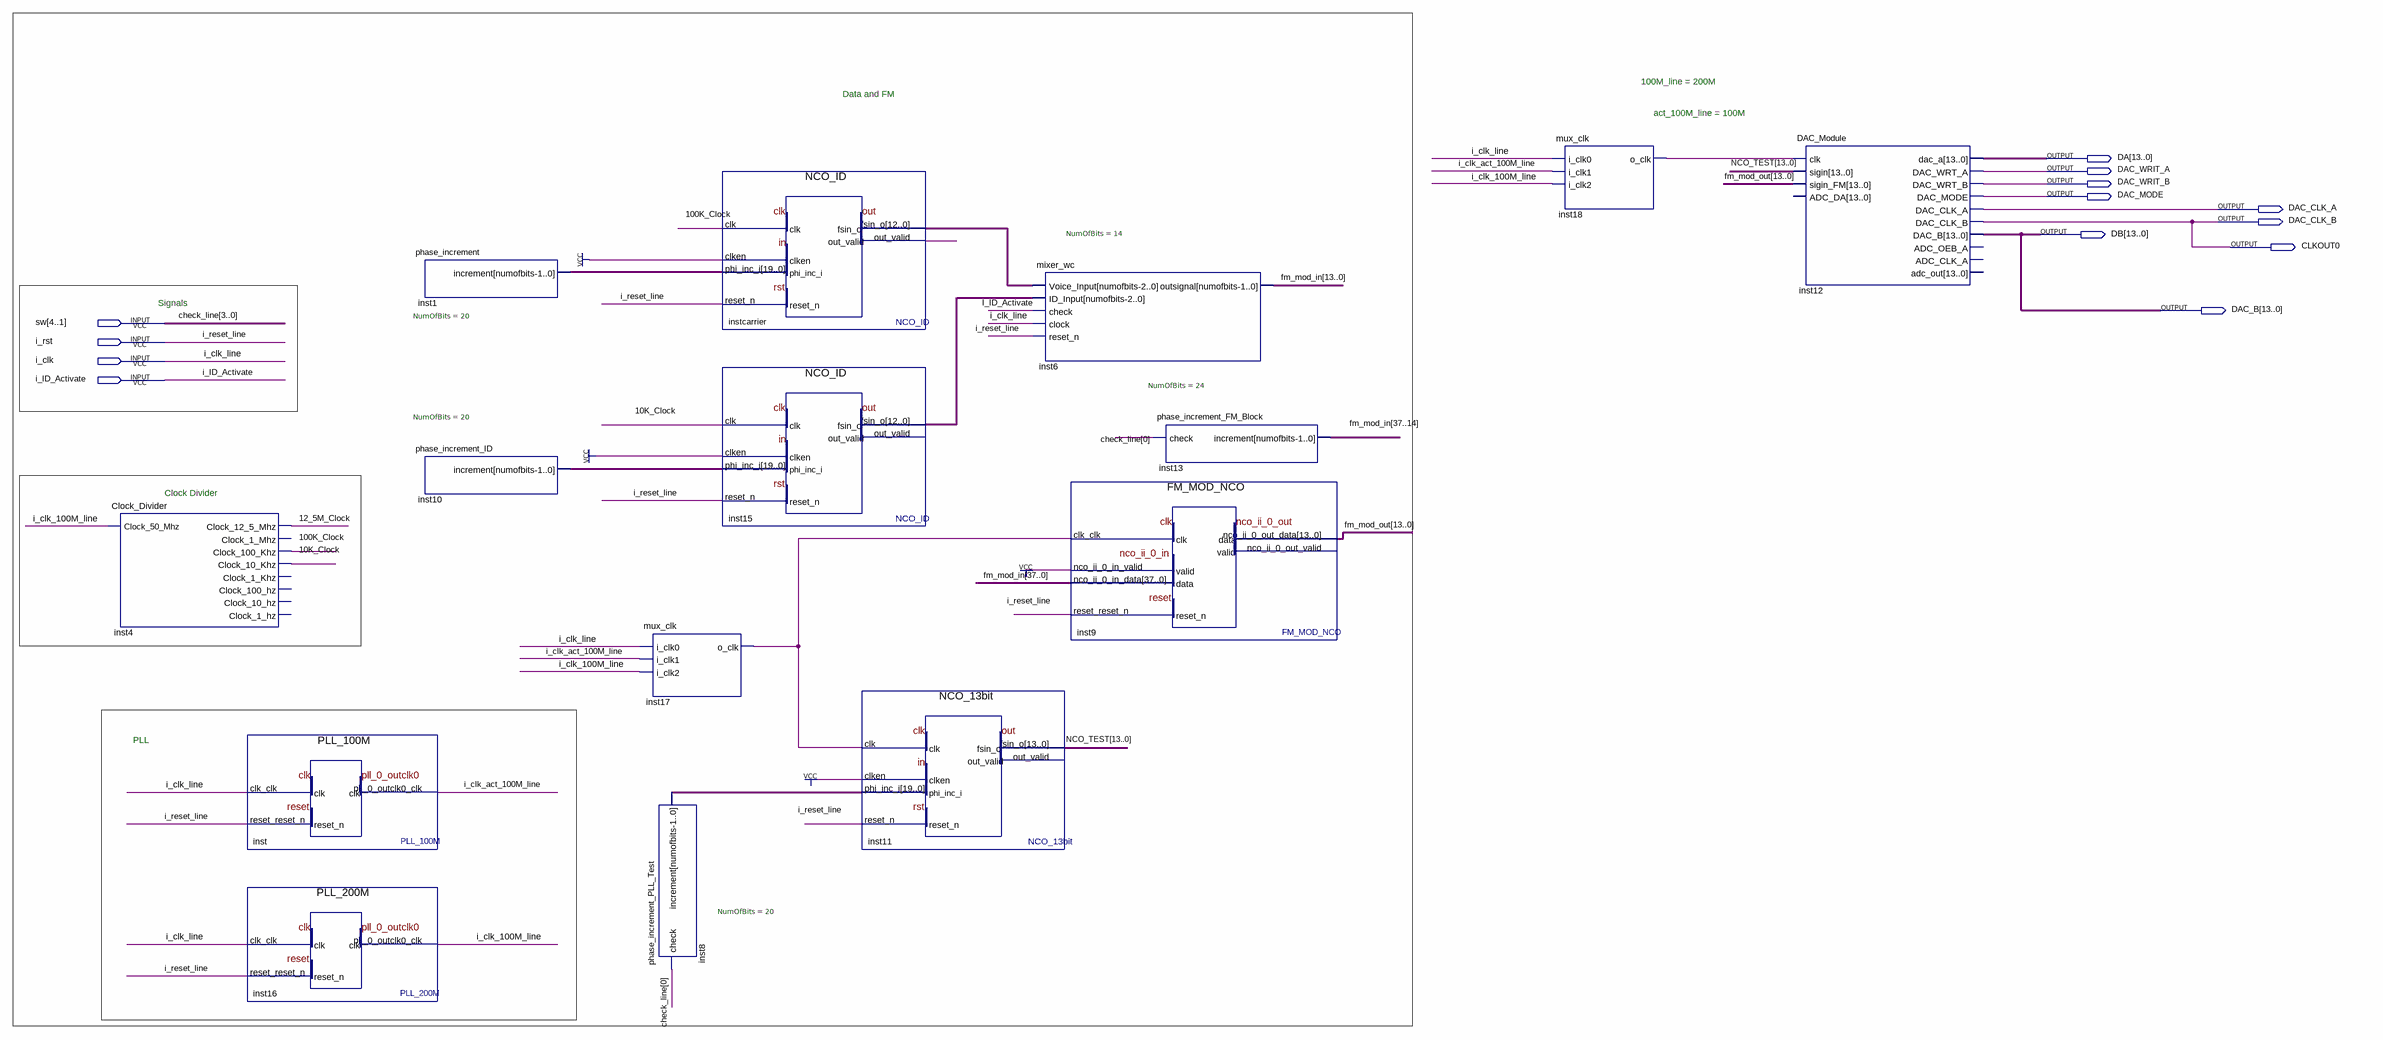
[diagram p0: schematic sheet]
// Quartus schematic Main_Data.bdf as structural Verilog: 15 symbols, 13 pins
module Main_Data (
  input  [4:1] sw,
  input  i_rst,
  input  i_clk,
  input  i_ID_Activate,
  output [13:0] DA,
  output DAC_WRIT_A,
  output DAC_WRIT_B,
  output DAC_MODE,
  output DAC_CLK_A,
  output DAC_CLK_B,
  output [13:0] DB,
  output CLKOUT0,
  output [13:0] DAC_B
);

  wire \10K_Clock , \12_5M_Clock , \100K_Clock , i_clk_100M_line, i_clk_act_100M_line, inst17_o_clk,
       inst18_o_clk, instcarrier_out_valid;
  wire [12:0] inst15_fsin_o, instcarrier_fsin_o;
  wire [13:0] fm_mod_out, NCO_TEST;
  wire [19:0] inst1_increment, inst8_increment, inst10_increment;
  wire [37:0] fm_mod_in;

  Clock_Divider inst4 (
    .Clock_50_Mhz(i_clk_100M_line), .Clock_12_5_Mhz(\12_5M_Clock ), .Clock_100_Khz(\100K_Clock ),
    .Clock_10_Khz(\10K_Clock ));  // open: Clock_1_Mhz, Clock_1_Khz, Clock_100_hz, Clock_10_hz, Clock_1_hz
  PLL_100M inst (.clk_clk(i_clk), .reset_reset_n(i_rst), .pll_0_outclk0_clk(i_clk_act_100M_line));
  PLL_200M inst16 (.clk_clk(i_clk), .reset_reset_n(i_rst), .pll_0_outclk0_clk(i_clk_100M_line));
  phase_increment #(.NumOfBits(20)) inst1 (.increment(inst1_increment));
  phase_increment_ID #(.NumOfBits(20)) inst10 (.increment(inst10_increment));
  mux_clk inst17 (.i_clk0(i_clk), .i_clk1(i_clk_act_100M_line), .i_clk2(i_clk_100M_line), .o_clk(inst17_o_clk));
  phase_increment_PLL_Test #(.NumOfBits(20)) inst8 (.check(sw[1]), .increment(inst8_increment));
  NCO_ID instcarrier (
    .clk(\100K_Clock ), .clken(1'b1), .phi_inc_i(inst1_increment), .reset_n(i_rst),
    .fsin_o(instcarrier_fsin_o), .out_valid(instcarrier_out_valid));
  NCO_ID inst15 (
    .clk(\10K_Clock ), .clken(1'b1), .phi_inc_i(inst10_increment), .reset_n(i_rst), .fsin_o(inst15_fsin_o));  // open: out_valid
  NCO_13bit inst11 (
    .clk(inst17_o_clk), .clken(1'b1), .phi_inc_i(inst8_increment), .reset_n(i_rst), .fsin_o(NCO_TEST));  // open: out_valid
  mixer_wc #(.NumOfBits(14)) inst6 (
    .Voice_Input(instcarrier_fsin_o), .ID_Input(inst15_fsin_o), .check(i_ID_Activate), .clock(i_clk),
    .reset_n(i_rst), .outsignal(fm_mod_in[13:0]));
  FM_MOD_NCO inst9 (
    .clk_clk(inst17_o_clk), .nco_ii_0_in_valid(1'b1), .nco_ii_0_in_data(fm_mod_in), .reset_reset_n(i_rst),
    .nco_ii_0_out_data(fm_mod_out));  // open: nco_ii_0_out_valid
  phase_increment_FM_Block #(.NumOfBits(24)) inst13 (.check(sw[1]), .increment(fm_mod_in[37:14]));
  mux_clk inst18 (.i_clk0(i_clk), .i_clk1(i_clk_act_100M_line), .i_clk2(i_clk_100M_line), .o_clk(inst18_o_clk));
  DAC_Module inst12 (
    .clk(inst18_o_clk), .sigin(NCO_TEST), .sigin_FM(fm_mod_out), .dac_a(DA), .DAC_WRT_A(DAC_WRIT_A),
    .DAC_WRT_B(DAC_WRIT_B), .DAC_MODE(DAC_MODE), .DAC_CLK_A(DAC_CLK_A), .DAC_CLK_B(CLKOUT0), .DAC_B(DAC_B));  // open: ADC_DA, ADC_OEB_A, ADC_CLK_A, adc_out

  assign DAC_CLK_B = CLKOUT0;
  assign DB = DAC_B;

  // Other names for the same wires on the sheet: check_line[3:0] = sw; i_clk_line = i_clk; i_reset_line = i_rst

  // Notes on the sheet:
  //   100M_line = 200M
  //   Data and FM
  //   act_100M_line = 100M
  //   Signals
  //   Clock Divider
  //   PLL
endmodule
